# EAGLE schematic 7seg&Buttons (EAGLE 6.5.0)
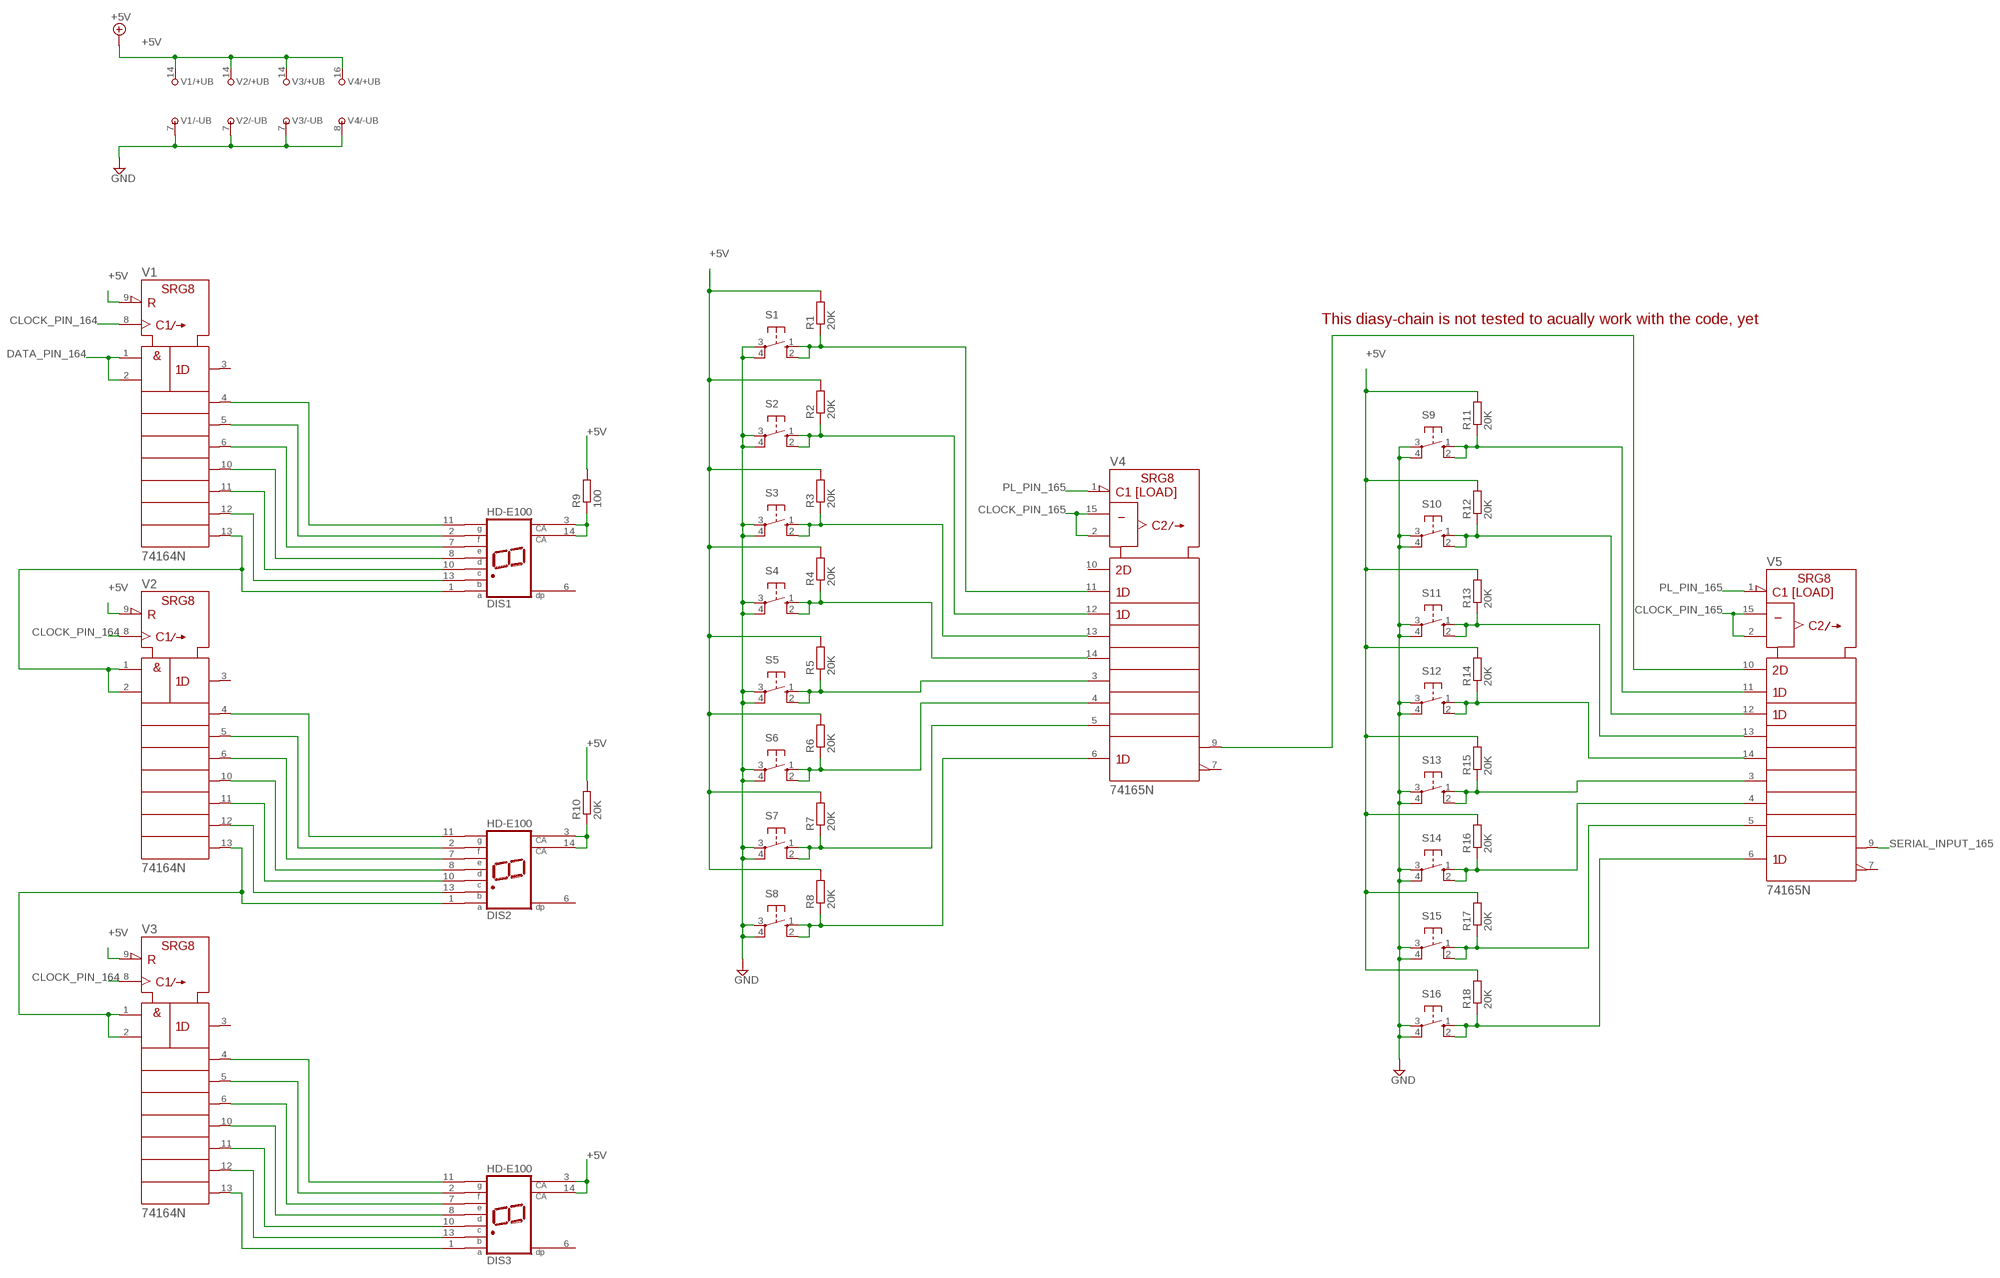
[diagram p0: schematic, sheet 1]

## Parts
DIS1  HD-E100  [HDSP-I]
DIS2  HD-E100  [HDSP-I]
DIS3  HD-E100  [HDSP-I]
R1  20K  R-EU_0204/7  [0204/7]
R2  20K  R-EU_0204/7  [0204/7]
R3  20K  R-EU_0204/7  [0204/7]
R4  20K  R-EU_0204/7  [0204/7]
R5  20K  R-EU_0204/7  [0204/7]
R6  20K  R-EU_0204/7  [0204/7]
R7  20K  R-EU_0204/7  [0204/7]
R8  20K  R-EU_0204/7  [0204/7]
R9  100  R-EU_0204/7  [0204/7]
R10  20K  R-EU_0204/7  [0204/7]
R11  20K  R-EU_0204/7  [0204/7]
R12  20K  R-EU_0204/7  [0204/7]
R13  20K  R-EU_0204/7  [0204/7]
R14  20K  R-EU_0204/7  [0204/7]
R15  20K  R-EU_0204/7  [0204/7]
R16  20K  R-EU_0204/7  [0204/7]
R17  20K  R-EU_0204/7  [0204/7]
R18  20K  R-EU_0204/7  [0204/7]
S1  40-XX  [B3F-40XX]
S2  40-XX  [B3F-40XX]
S3  40-XX  [B3F-40XX]
S4  40-XX  [B3F-40XX]
S5  40-XX  [B3F-40XX]
S6  40-XX  [B3F-40XX]
S7  40-XX  [B3F-40XX]
S8  40-XX  [B3F-40XX]
S9  40-XX  [B3F-40XX]
S10  40-XX  [B3F-40XX]
S11  40-XX  [B3F-40XX]
S12  40-XX  [B3F-40XX]
S13  40-XX  [B3F-40XX]
S14  40-XX  [B3F-40XX]
S15  40-XX  [B3F-40XX]
S16  40-XX  [B3F-40XX]
V1  74164N  [DIL14]
V2  74164N  [DIL14]
V3  74164N  [DIL14]
V4  74165N  [DIL16]
V5  74165N  [DIL16]

## Nets
+5V: DIS3.3(CA) DIS3.14(CA) R1.2 R2.2 R3.2 R4.2 R5.2 R6.2 R7.2 R8.2 R9.2 R10.2 R11.2 R12.2 R13.2 R14.2 R15.2 R16.2 R17.2 R18.2 V1.9(!CLR) V1.14(+UB) V2.9(!CLR) V2.14(+UB) V3.9(!CLR) V3.14(+UB) V4.16(+UB)
CLOCK_PIN_164: V1.8(CLK) V2.8(CLK) V3.8(CLK)
CLOCK_PIN_165: V4.2(CLK) V4.15(CLK_INH) V5.2(CLK) V5.15(CLK_INH)
DATA_PIN_164: V1.1(A) V1.2(B)
GND: S1.3(P) S1.4(P1) S2.3(P) S2.4(P1) S3.3(P) S3.4(P1) S4.3(P) S4.4(P1) S5.3(P) S5.4(P1) S6.3(P) S6.4(P1) S7.3(P) S7.4(P1) S8.3(P) S8.4(P1) S9.3(P) S9.4(P1) S10.3(P) S10.4(P1) S11.3(P) S11.4(P1) S12.3(P) S12.4(P1) S13.3(P) S13.4(P1) S14.3(P) S14.4(P1) S15.3(P) S15.4(P1) S16.3(P) S16.4(P1) V1.7(-UB) V2.7(-UB) V3.7(-UB) V4.8(-UB)
N$1: DIS2.1(A) V2.13(QH) V3.1(A) V3.2(B)
N$2: DIS1.11(G) V1.4(QB)
N$3: DIS1.2(F) V1.5(QC)
N$4: DIS1.7(E) V1.6(QD)
N$5: DIS1.8(D) V1.10(QE)
N$6: DIS1.10(C) V1.11(QF)
N$7: DIS1.13(B) V1.12(QG)
N$8: DIS3.11(G) V3.4(QB)
N$9: DIS1.1(A) V1.13(QH) V2.1(A) V2.2(B)
N$10: DIS2.11(G) V2.4(QB)
N$11: DIS2.2(F) V2.5(QC)
N$12: DIS2.7(E) V2.6(QD)
N$13: DIS2.8(D) V2.10(QE)
N$14: DIS2.10(C) V2.11(QF)
N$15: DIS2.13(B) V2.12(QG)
N$16: DIS1.3(CA) DIS1.14(CA) R9.1
N$17: DIS3.2(F) V3.5(QC)
N$18: DIS3.7(E) V3.6(QD)
N$19: DIS3.8(D) V3.10(QE)
N$20: DIS3.10(C) V3.11(QF)
N$21: DIS3.13(B) V3.12(QG)
N$22: DIS3.1(A) V3.13(QH)
N$23: DIS2.3(CA) DIS2.14(CA) R10.1
N$24: R18.1 S16.1(S) S16.2(S1) V5.6(H)
N$25: R17.1 S15.1(S) S15.2(S1) V5.5(G)
N$26: R16.1 S14.1(S) S14.2(S1) V5.4(F)
N$27: R15.1 S13.1(S) S13.2(S1) V5.3(E)
N$28: R14.1 S12.1(S) S12.2(S1) V5.14(D)
N$29: R13.1 S11.1(S) S11.2(S1) V5.13(C)
N$30: R8.1 S8.1(S) S8.2(S1) V4.6(H)
N$31: R7.1 S7.1(S) S7.2(S1) V4.5(G)
N$32: R6.1 S6.1(S) S6.2(S1) V4.4(F)
N$33: R5.1 S5.1(S) S5.2(S1) V4.3(E)
N$34: R4.1 S4.1(S) S4.2(S1) V4.14(D)
N$35: R3.1 S3.1(S) S3.2(S1) V4.13(C)
N$36: R2.1 S2.1(S) S2.2(S1) V4.12(B)
N$37: R1.1 S1.1(S) S1.2(S1) V4.11(A)
N$38: R12.1 S10.1(S) S10.2(S1) V5.12(B)
N$39: R11.1 S9.1(S) S9.2(S1) V5.11(A)
N$40: V4.9(QH) V5.10(SER)
PL_PIN_165: V4.1(SH/!LD) V5.1(SH/!LD)
SERIAL_INPUT_165: V5.9(QH)
Unconnected: DIS1.6(DP) DIS2.6(DP) DIS3.6(DP) V1.3(QA) V2.3(QA) V3.3(QA) V4.7(!QH) V4.10(SER) V5.7(!QH)

## Notes on the sheet
- This diasy-chain is not tested to acually work with the code, yet

## Power pins joined to a net without a drawn wire
+UB: V5.16(+UB)
-UB: V5.8(-UB)

## Library data of the parts
DIS1-DIS3 = display-hp:HD-E100: LED DISPLAY 1-character 7 segment, decimal point left; OC_FARNELL: unknown; OC_NEWARK: unknown
R1-R18 = resistor:R-EU_: RESISTOR, European symbol
S1-S16 = switch-omron:40-XX: OMRON SWITCH; MF: OMRON COMPONENTS USA; MPN: B3F-4000; OC_FARNELL: 176434; OC_NEWARK: 36K3105
V1-V3 = 74ttl-din:74*164: 8-bit parallel out SHIFT REGISTER
V4 V5 = 74ttl-din:74*165: 8-bit parallel load SHIFT REGISTER